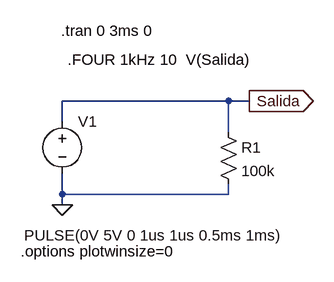
[diagram p0: schematic E4-tren-pulsos.asc]
E4-tren-pulsos.asc, the LTspice schematic file:
Version 4
SHEET 1 880 680
WIRE -224 112 -480 112
WIRE -192 112 -224 112
WIRE -480 144 -480 112
WIRE -224 160 -224 112
WIRE -480 256 -480 224
WIRE -224 256 -224 240
WIRE -224 256 -480 256
WIRE -480 272 -480 256
FLAG -480 272 0
FLAG -192 112 Salida
IOPIN -192 112 Out
SYMBOL voltage -480 128 R0
WINDOW 3 -59 191 Left 2
WINDOW 123 0 0 Left 0
WINDOW 39 0 0 Left 0
SYMATTR InstName V1
SYMATTR Value PULSE(0V 5V 0 1us 1us 0.5ms 1ms)
SYMBOL res -240 144 R0
SYMATTR InstName R1
SYMATTR Value 100k
TEXT -544 344 Left 2 !.options plotwinsize=0
TEXT -482 4 Left 2 !.tran 0 3ms 0
TEXT -472 48 Left 2 !.FOUR 1kHz 10  V(Salida)

The netlist it stands for:
* E4-tren-pulsos.asc
V1 Salida 0 PULSE(0V 5V 0 1us 1us 0.5ms 1ms)
R1 Salida 0 100k
.options plotwinsize=0
.tran 0 3ms 0
.FOUR 1kHz 10  V(Salida)
.backanno
.end